# EasyEDA Pro project 电子琴.eprj

# Board PCB
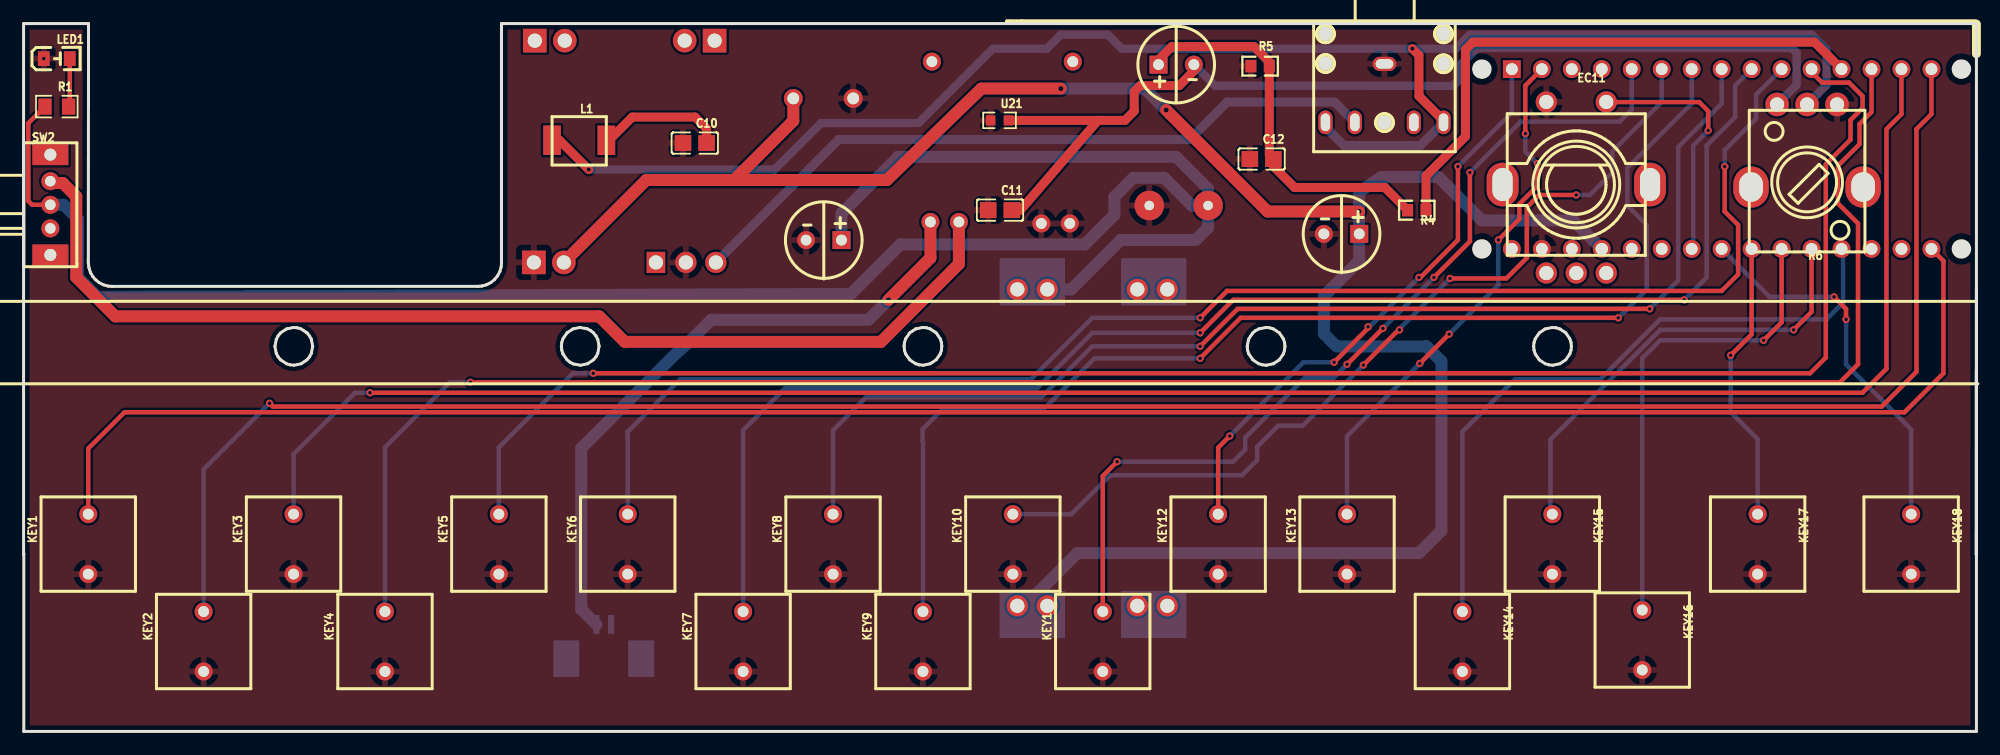
[diagram p0: board, top side]
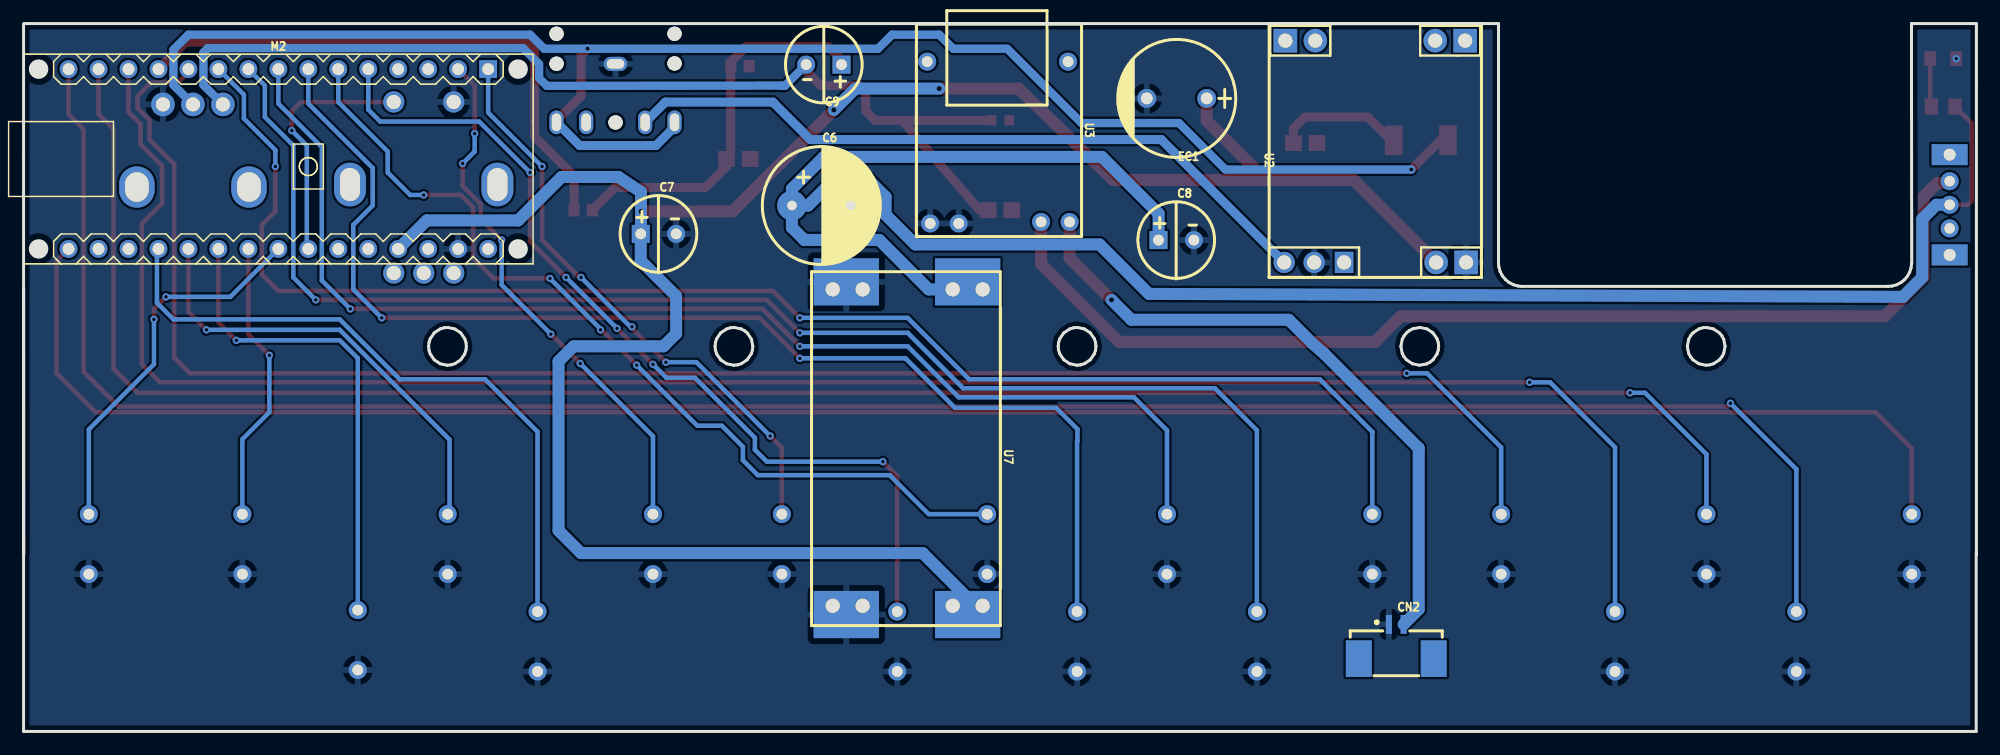
[diagram p1: board, bottom side, seen from below]

Outline 165.5 x 59.99 mm; copper layers: Top Layer, Bottom Layer. Coordinates in mm from the lower left corner of the outline.
Outline path: 0,14.99 0,59.99 5.5,59.99 5.5,54.99 5.48,39.65 ; 0.02,15.11 0.02,0 165.5,0 165.5,59.94 165.45,59.99 40.5,59.99 40.5,39.67 40.47,39.38 40.36,38.98 40.18,38.62 39.92,38.3 39.6,38.04 39.24,37.86 38.84,37.75 38.5,37.72 7.51,37.72 7.15,37.74 6.76,37.85 6.4,38.04 6.08,38.3 5.86,38.56 5.66,38.92 5.53,39.31 5.49,39.71 ; 165.48,14.99 165.5,37.6 ; 21.3,32.64 21.41,33.23 21.57,33.52 21.78,33.78 22.28,34.11 22.87,34.24 23.2,34.21 23.52,34.11 24.02,33.78 24.23,33.52 24.39,33.23 24.5,32.64 24.39,32.04 24.23,31.75 24.02,31.5 23.52,31.16 22.93,31.04 22.6,31.06 22.28,31.16 21.78,31.5 21.57,31.75 21.41,32.04 21.3,32.64 ; 45.58,32.64 45.61,32.97 45.71,33.28 46.05,33.78 46.56,34.11 47.15,34.24 47.74,34.13 48.04,33.98 48.3,33.78 48.51,33.52 48.66,33.23 48.78,32.64 48.66,32.04 48.51,31.75 48.3,31.5 47.79,31.16 47.2,31.04 46.61,31.14 46.31,31.29 46.05,31.5 45.71,31.99 45.61,32.31 45.58,32.64 ; 74.62,32.64 74.65,32.97 74.75,33.28 75.1,33.78 75.6,34.11 76.19,34.24 76.52,34.21 76.84,34.11 77.34,33.78 77.68,33.28 77.78,32.97 77.82,32.64 77.78,32.31 77.68,31.99 77.34,31.5 76.84,31.16 76.25,31.04 75.92,31.07 75.6,31.16 75.1,31.5 74.75,31.99 74.65,32.31 74.62,32.64 ; 103.7,32.64 103.81,33.23 104.14,33.74 104.39,33.95 104.68,34.11 105.27,34.24 105.6,34.21 105.92,34.11 106.42,33.78 106.76,33.28 106.86,32.97 106.9,32.64 106.86,32.31 106.76,31.99 106.42,31.5 105.92,31.16 105.33,31.04 105,31.06 104.68,31.16 104.18,31.5 103.83,31.99 103.73,32.31 103.7,32.64 ; 127.98,32.64 128.01,32.97 128.11,33.28 128.45,33.78 128.96,34.11 129.55,34.24 129.88,34.21 130.19,34.11 130.7,33.78 131.04,33.28 131.14,32.97 131.18,32.64 131.14,32.31 131.04,31.99 130.7,31.5 130.19,31.16 129.6,31.04 129.27,31.06 128.96,31.16 128.45,31.5 128.11,31.99 128.01,32.31 127.98,32.64
Stack: Top Layer 0.035mm / Dielectric1 1.51mm FR4 er 4.5 / Bottom Layer 0.035mm

## Design rules (mm)
template: JLCPCB Capability(Two Layers Board)
spacing copperThickness1oz (default): track to track 0.102, other pairs 0.152 to 0.3
spacing copperThickness2oz: track to track 0.203, other pairs 0.152 to 0.3
track width copperThickness1oz (default): min 0.127, default 0.254, max 2.54
track width copperThickness2oz: min 0.203, default 0.254, max 2.54
differential pair differentialPair (default): width min 0.127, default 0.254, max 2.54; gap min 0.152, default 0.152
via viaSize (default): diameter min 0.5, default 0.61, max 10; hole min 0.3, default 0.305, max 6.3

## Placement (name value [footprint] x y rotation side)
C6  1000uF  [CAP1000UFX25V-10X20(5MM, D-0.8)]  97.89 44.57 180 bottom
C7  直插电容10UF  [直插电容]  111.7 42.17 180 bottom
C8  直插电容10UF  [直插电容]  67.81 41.64 180 bottom
C9  直插电容10UF  [直插电容]  97.68 56.51 0 bottom
C10  220nF  [C0805]  56.88 49.86 0 top
C11  470nF  [C0805]  82.75 44.18 0 top
C12  100nF  [C0805]  104.92 48.51 0 top
CN2  1.25-2P  [CONN-SMD_1.25-2P]  49.17 7.62 180 bottom
EC1  4700uF  [CAP-TH_BD10.0-P5.00-D1.0-FD]  67.77 53.65 0 bottom
EC11  EC11编码器  [EC11]  131.59 46.1 0 top
KEY1  无声按键  [无声硅胶轻触按键开关 8*8两脚 导电胶]  5.48 15.87 90 top
KEY2  无声按键  [无声硅胶轻触按键开关 8*8两脚 导电胶]  15.26 7.62 90 top
KEY3  无声按键  [无声硅胶轻触按键开关 8*8两脚 导电胶]  22.88 15.87 90 top
KEY4  无声按键  [无声硅胶轻触按键开关 8*8两脚 导电胶]  30.63 7.62 90 top
KEY5  无声按键  [无声硅胶轻触按键开关 8*8两脚 导电胶]  40.28 15.87 90 top
KEY6  无声按键  [无声硅胶轻触按键开关 8*8两脚 导电胶]  51.2 15.87 90 top
KEY7  无声按键  [无声硅胶轻触按键开关 8*8两脚 导电胶]  60.98 7.62 90 top
KEY8  无声按键  [无声硅胶轻触按键开关 8*8两脚 导电胶]  68.6 15.87 90 top
KEY9  无声按键  [无声硅胶轻触按键开关 8*8两脚 导电胶]  76.22 7.62 90 top
KEY10  无声按键  [无声硅胶轻触按键开关 8*8两脚 导电胶]  83.84 15.87 90 top
KEY11  无声按键  [无声硅胶轻触按键开关 8*8两脚 导电胶]  91.46 7.62 90 top
KEY12  无声按键  [无声硅胶轻触按键开关 8*8两脚 导电胶]  101.24 15.87 90 top
KEY13  无声按键  [无声硅胶轻触按键开关 8*8两脚 导电胶]  112.16 15.87 90 top
KEY14  无声按键  [无声硅胶轻触按键开关 8*8两脚 导电胶]  121.94 7.62 270 top
KEY15  无声按键  [无声硅胶轻触按键开关 8*8两脚 导电胶]  129.56 15.87 270 top
KEY16  无声按键  [无声硅胶轻触按键开关 8*8两脚 导电胶]  137.18 7.75 270 top
KEY17  无声按键  [无声硅胶轻触按键开关 8*8两脚 导电胶]  146.96 15.87 270 top
KEY18  无声按键  [无声硅胶轻触按键开关 8*8两脚 导电胶]  159.97 15.87 270 top
L1  0420贴片电感 10uh  [0420贴片电感]  44.79 52.11 0 top
LED1  LED0805  [LED0805-RD]  2.81 57.02 0 top
M2  -  [ARDUINO-NANO-3.0]  143.91 48.51 180 bottom
R1  1kΩ  [R0805]  2.81 52.96 0 top
R4  220  [R 0603]  118.07 44.18 180 top
R5  100  [R 0603]  104.79 56.39 0 top
R6  10K  [RV09_RV0932]  151.15 49.64 180 top
SW2  SK12D07VG3  [SWITCH-SK12D07VG3]  2.27 42.63 0 top
U2  PAM8403模组  [PAM8403小板]  50.95 38.48 90 bottom
U3  -  [超小TP4056充放保护模块]  84.22 46.1 270 bottom
U7  -  [XL63070]  86.76 37.46 270 bottom
U19  USB_Switch-Box-rescue_Audio_Jack_PJ-307C-JLC_Audio_Jack  [AUDIO-PJ307C]  115.33 55.37 0 top
U21  1.8K  [R0603]  82.71 51.79 0 top

## Footprints (pads in the part's own frame, mm; a bottom-side part is the same pattern mirrored in y, then rotated)
0420贴片电感
  rect 1.5x2.5 smd: 1(0,-2) 2(4.602,-2.002)
ARDUINO-NANO-3.0
  rect 1.508x1.508 hole 1x1: J1.1(17.78,7.62)
  round 1.508 hole 1x1: J1.2(15.24,7.62) J1.3(12.7,7.62) J1.4(10.16,7.62) J1.5(7.62,7.62) J1.6(5.08,7.62) J1.7(2.54,7.62) J1.8(0,7.62) J1.9(-2.54,7.62) J1.10(-5.08,7.62) J1.11(-7.62,7.62) J1.12(-10.16,7.62) J1.13(-12.7,7.62) J1.14(-15.24,7.62) J1.15(-17.78,7.62) J2.1(17.78,-7.62) J2.2(15.24,-7.62) J2.3(12.7,-7.62) J2.5(7.62,-7.62) J2.6(5.08,-7.62) J2.7(2.54,-7.62) J2.8(0,-7.62) J2.9(-2.54,-7.62) J2.10(-5.08,-7.62) J2.11(-7.62,-7.62) J2.12(-10.16,-7.62) J2.13(-12.7,-7.62) J2.14(-15.24,-7.62) J2.15(-17.78,-7.62)
  round 1.508 hole 1.05x1: J2.4(10.16,-7.62)
AUDIO-PJ307C
  round 1.2 hole 1.2: 0(-5,3.76) 0(-5,1.244) 0(0,-3.76) 0(5,3.76) 0(5,1.22)
  oval 2x1.2 hole 1.5x0.8: 1(0,1.205)
  oval 1.2x2 hole 0.8x1.5: 2(5.004,-3.748) 3(2.489,-3.748) 4(-2.511,-3.748) 5(-5.004,-3.748)
C0805
  rect 1.41x1.35 smd: 1(-1,0) 2(1,0)
CAP1000UFX25V-10X20(5MM, D-0.8)
  round 2.5 hole 0.8: 1(-2.491,0) 2(2.492,0)
CAP-TH_BD10.0-P5.00-D1.0-FD
  round 1.6 hole 1: 1(-2.54,0) 2(2.54,0)
CONN-SMD_1.25-2P
  rect 0.52x1.6 smd: 1(-0.625,1.45) 2(0.625,1.45)
  rect 2.2x3.1 smd: 3(3.175,-1.45) 4(-3.175,-1.45)
EC11
  oval 2.7x3.7 hole 1.7x2.8: 0(-6.25,0.25) 0(6.25,0.25)
  round 1.8 hole 1.2: A(-2.54,-7.25) B(2.54,-7.25) C(0,-7.25) D(-2.54,7.25) E(2.54,7.25)
LED0805-RD
  rect 1x1.25 smd: 1(-1.1,0) 2(1.1,0)
PAM8403小板
  round 1.8 hole 1.2: 1(1.27,7.723) 2(1.27,5.183)
  rect 1.8x1.575 hole 1.2: 3(1.27,2.643)
  round 2 hole 1.2: 4(1.27,-5.16) 7(20.066,5.08) 8(20.066,-5.08)
  rect 2x2 hole 1.2: 5(1.27,-7.7) 6(20.066,7.62) 9(20.066,-7.62)
R0603
  rect 0.806x0.864 smd: 1(-0.753,0) 2(0.753,0)
R0805
  rect 1.133x1.377 smd: 1(-1,0) 2(1,0)
R 0603
  rect 0.94x1.06 smd: 1(-0.78,0) 2(0.78,0)
RV09_RV0932
  round 2 hole 1.2: 1(-2.54,-3.5) 2(0,-3.5) 3(2.54,-3.5)
  oval 3x3.5 hole 2x2.5: 4(4.75,3.5) 5(-4.75,3.5)
SWITCH-SK12D07VG3
  round 1.524 hole 0.889: 1(0,4) 2(0,2) 3(0,0)
  rect 0x0 hole 1.016: 4(-0.5,6.25) 4(-0.5,-2.25) 4(0.5,6.25) 4(0.5,-2.25)
  rect 3.048x1.778 hole 1.016: 4(0,6.25) 4(0,-2.25)
XL63070
  rect 4x5.54 smd: 1(-0.635,1.27) 2(-0.635,-9.017) 3(27.559,1.27) 4(27.559,-9.017)
  round 1.8 hole 1.2: 1(0,0) 1(0,2.54) 2(0,-10.17) 2(0,-7.63) 3(26.82,0) 3(26.82,2.54) 4(26.82,-10.17) 4(26.82,-7.63)
无声硅胶轻触按键开关 8*8两脚 导电胶
  round 1.524 hole 0.914: 1(-2.54,0) 2(2.54,0)
直插电容
  rect 1.524x1.524 hole 0.914: 1(-1.5,0)
  round 1.524 hole 0.914: 2(1.5,0)
超小TP4056充放保护模块
  round 1.524 hole 0.914: 1(-10.668,7.239) 2(-10.668,-4.699) 3(3.048,-4.445) 4(3.048,-2.032) 5(2.921,4.953) 6(2.921,7.366)

## Nets
5V: C7.1 EC1.1 M2.J2.4 U2.4 U7.3
GND: C6.2 C7.2 C8.2 C10.1 C11.1 C12.1 CN2.1 EC1.2 EC11.D KEY1.1 KEY2.1 KEY3.1 KEY4.1 KEY5.1 KEY6.1 KEY7.1 KEY8.1 KEY9.1 KEY10.1 KEY11.1 KEY12.1 KEY13.1 KEY14.2 KEY15.2 KEY16.2 KEY17.2 KEY18.2 LED1.1 M2.J2.2 R5.1 R6.1 U2.2 U2.5 U3.3 U3.4 U7.2 U7.4 U19.1 U21.1
BAT: CN2.2 U3.6
C6_1: C6.1 C8.1 R1.1 SW2.2 U7.1
C9_1: C9.1 C12.2 R4.2 R5.2
C9_2: C9.2 C11.2 R6.3 U21.2
D9: M2.J1.12 R4.1
EC11_0: EC11.0
EC11_A: EC11.A
EC11_B: EC11.B
EC11_C: EC11.C
EC11_E: EC11.E M2.J2.7
L1_1: L1.1 R6.2 U19.2 U19.5
L1_2: C10.2 L1.2
LED1_2: LED1.2 R1.2
M2_J1.1: KEY12.2 M2.J1.1
M2_J1.2: KEY13.2 M2.J1.2
M2_J1.3: M2.J1.3
M2_J1.4: M2.J1.4
M2_J1.5: KEY11.2 M2.J1.5
M2_J1.6: KEY10.2 M2.J1.6
M2_J1.7: KEY9.2 M2.J1.7
M2_J1.8: KEY8.2 M2.J1.8
M2_J1.9: KEY7.2 M2.J1.9
M2_J1.10: KEY6.2 M2.J1.10
M2_J1.11: KEY5.2 M2.J1.11
M2_J1.13: KEY4.2 M2.J1.13
M2_J1.14: KEY3.2 M2.J1.14
M2_J1.15: KEY2.2 M2.J1.15
M2_J2.1: M2.J2.1
M2_J2.3: M2.J2.3
M2_J2.5: M2.J2.5
M2_J2.6: M2.J2.6
M2_J2.8: KEY18.1 M2.J2.8
M2_J2.9: KEY17.1 M2.J2.9
M2_J2.10: KEY16.1 M2.J2.10
M2_J2.11: KEY15.1 M2.J2.11
M2_J2.12: KEY14.1 M2.J2.12
M2_J2.13: M2.J2.13
M2_J2.14: M2.J2.14
M2_J2.15: KEY1.2 M2.J2.15
SW2_1: SW2.1 U3.5
SW2_3: SW2.3
U3_1: U3.1
U3_2: U3.2
U19_4: U2.1 U19.4

Pads without a net: CN2 3 4; R6 4 5; SW2 4; U2 3 6 7 8 9; U19 0 3

## Via types
v1: diameter 0.7, hole 0.35, Top Layer to Bottom Layer, 2 vias
v2: diameter 0.889, hole 0.432, Top Layer to Bottom Layer, 4 vias
v3: diameter 0.62, hole 0.31, Top Layer to Bottom Layer, 38 vias

## Routing (per net, layer and track width the routed paths; a pad name or vN(x,y) marks a point on that pad's centre or on a via; arc(x,y) is an arc through that point)
5V: length 187.1
  Top Layer w1.016: EC1.1 65.23,51.75 60.22,46.73 ; v2(96.83,52.67) 105.43,44.07 v2(113.18,44.07) ; 60.22,46.73 73.17,46.73 81.17,54.48 v2(87.9,54.48) ; 60.22,46.73 52.77,46.73 U2.4
  Bottom Layer w1.016: v2(87.9,54.48) 95.01,54.48 v2(96.83,52.67) ; 113.18,42.2 v2(113.18,44.07) 113.18,45.72 115.08,46.99 119.91,46.99 123.59,43.31 131.34,43.31 M2.J2.4 ; U7.3 85.49,11.3 89.3,15.11 118.26,15.11 120.16,17.02 120.16,31.37 118.89,32.64 111.27,32.64 110.2,33.71 110.2,36.9 113.2,39.9 C7.1
GND:
  vias: v3(1.71,57.02)
BAT: length 54.7
  Top Layer w1.016: v2(73.3,36.58) 76.85,40.13 U3.6
  Bottom Layer w1.016: v2(73.3,36.58) 71.61,34.89 58.28,34.89 56.28,32.89 55.26,32 47.26,24 47.26,10.35 CN2.2
C6_1: length 176.3
  Top Layer w0.381: R1.1 0.4,51.55 0.4,44.96 0.72,44.63 SW2.2
  Bottom Layer w1.016: C6.1 100.38,45.99 97.68,48.69 74.11,48.69 69.31,43.9 C8.1 ; C6.1 99.01,44.57 96.67,46.92 94.05,46.92 92.44,45.31 92.44,43.78 89.93,41.27 74.31,41.27 70.12,37.08 6.24,36.83 4.59,38.48 4.59,43.43 3.39,44.63 2.27,44.63 ; C6.1 100.38,42.71 99.33,41.66 92.98,41.66 88.79,37.46 U7.1
C9_1: length 32.7
  Top Layer w0.762: C9.1 96.18,56.92 97.3,58.04 104.29,58.04 105.57,56.75 R5.2 105.57,48.86 C12.2 105.92,47.89 107.71,46.1 115.37,46.1 R4.2
C9_2: length 89
  Top Layer w0.762: 91.05,51.79 84.49,44.18 C11.2 ; 91.05,51.79 93.34,51.79 94.13,52.58 94.13,54.23 94.63,54.74 97.94,54.74 99.18,55.98 C9.2 ; 91.05,51.79 83.46,51.79
  Bottom Layer w0.7: 101.11,54.74 121.15,54.71 121.81,55.37 121.81,56.56 123.17,57.91 149.88,57.91 150.26,57.53 150.26,54.79 148.61,53.14 ; C9.2 100.98,54.71 101.26,54.71
D9: length 48.1
  Top Layer w0.762: R4.1 118.85,47.08 122.19,50.42 122.19,57.78 122.83,58.42 151.78,58.42 M2.J1.12
EC11_E: length 21.2
  Top Layer w0.381: v3(142.77,50.93) 142.77,52.58 142,53.34 134.13,53.34
  Bottom Layer w0.381: v3(142.77,50.93) 141.5,49.66 141.5,41.02 M2.J2.7
L1_1: length 139.8
  Top Layer w0.762: L1.1 45.42,50.11 v1(47.9,47.62) ; U19.2 120.34,51.76 118.26,53.85 118.26,57.31 v1(117.7,57.86)
  Bottom Layer w0.7: R6.2 152.8,54.79 152.8,57.78 151.53,59.05 122.57,59.05 121.38,57.86 v1(117.7,57.86) 93.08,57.86 91.89,59.05 87.9,59.05 86.71,57.86 82.14,57.86 75.84,51.56 67.58,51.56 63.65,47.62 v1(47.9,47.62)
  Bottom Layer w0.762: U19.5 110.33,51.23 111.91,49.66 118.37,49.66 U19.2
L1_2: length 10.9
  Top Layer w0.762: L1.2 49.61,50.1 51.58,52.07 56.91,52.07 57.88,51.1 C10.2
LED1_2: length 4.1
  Top Layer w0.381: R1.2 3.91,53.06 LED1.2
M2_J1.1: length 49.7
  Top Layer w0.381: v3(118.26,38.48) 118.38,38.48 121.56,41.66 v3(121.56,47.88) ; v3(102.23,25.04) 101.24,24.05 KEY12.2 ; v3(113.94,34.29) 113.94,34.16 v3(111.07,31.29)
  Bottom Layer w0.381: M2.J1.1 126.13,52.45 v3(121.56,47.88) ; 111.07,31.29 108.48,31.29 v3(102.23,25.04) ; v3(113.94,34.29) 114.06,34.29 v3(118.26,38.48)
M2_J1.2: length 45.4
  Top Layer w0.381: v3(124.99,41.66) 126.76,43.43 126.76,44.7 128.29,46.23 v3(128.29,48.13) ; v3(118.33,31.18) v3(120.81,33.67) ; M2.J1.2 127.27,54.74 v3(127.27,50.67)
  Bottom Layer w0.381: v3(128.29,48.13) 127.27,49.15 v3(127.27,50.67) ; v3(118.33,31.18) 112.16,25.02 KEY13.2 ; v3(124.99,41.66) 124.99,37.84 v3(120.81,33.67)
M2_J1.5: length 76.6
  Top Layer w0.381: KEY11.2 91.46,21.64 v3(92.67,22.86) ; v3(122.57,47.37) 122.57,41.53 v3(119.53,38.48) ; v3(112.16,31.11) v3(115.21,34.16)
  Bottom Layer w0.381: v3(122.57,47.37) 126.89,51.69 135.27,51.69 136.29,52.7 M2.J1.5 ; v3(112.16,31.11) 111.02,29.97 108.6,29.97 103.52,24.89 103.52,23.88 102.51,22.86 v3(92.67,22.86) ; v3(115.21,34.16) v3(119.53,38.48)
M2_J1.6: length 76.6
  Top Layer w0.381: v3(131.59,45.47) 128.45,45.47 127.4,44.42 127.4,40.13 125.66,38.39 v3(120.89,38.39) 120.82,38.47 ; v3(113.54,31.05) 116.53,34.03 v3(116.6,34.03)
  Bottom Layer w0.381: v3(131.59,45.47) 132.73,45.47 134.64,47.37 134.64,49.15 138.83,53.34 M2.J1.6 ; v3(116.6,34.03) 116.6,34.11 v3(120.89,38.39) ; v3(113.54,31.05) 108.4,25.91 106.32,25.91 104.54,24.13 104.54,22.99 103.27,21.72 92.09,21.72 88.79,18.41 KEY10.2
M2_J1.7: length 103.4
  Top Layer w0.381: v3(99.71,31.62) 103.14,35.05 v3(135.15,35.05)
  Bottom Layer w0.381: v3(135.15,35.05) 137.56,37.46 137.56,42.92 135.91,44.58 135.91,47.75 141.37,53.21 M2.J1.7 ; v3(99.71,31.62) 90.76,31.62 86.57,27.43 78,27.43 76.19,25.62 76.19,24.6 76.22,24.57 KEY9.2
M2_J1.8: length 103.4
  Top Layer w0.381: v3(99.71,32.64) 102.89,35.81 v3(137.81,35.81)
  Bottom Layer w0.381: v3(99.71,32.64) 90.57,32.64 86.25,28.32 71.4,28.32 68.6,25.52 KEY8.2 ; v3(137.81,35.81) 140.23,38.23 140.23,49.53 143.91,53.21 M2.J1.8
M2_J1.9: length 121.6
  Top Layer w0.381: v3(140.73,36.58) 102.51,36.58 v3(99.71,33.78)
  Bottom Layer w0.381: v3(99.71,33.78) 90.57,33.78 85.87,29.08 64.53,29.08 60.98,25.53 KEY7.2 ; M2.J1.9 145.05,54.74 145.05,52.07 142.64,49.66 142.64,38.48 v3(140.73,36.58)
M2_J1.10: length 126.6
  Top Layer w0.381: v3(99.71,35.05) 102,37.34 143.91,37.34 145.31,38.73 145.31,42.92 144.16,44.07 v3(144.16,47.88) 144.29,47.88
  Bottom Layer w0.381: v3(99.71,35.05) 90.57,35.05 85.36,29.84 55.64,29.84 51.16,25.36 51.2,25.31 KEY6.2 ; M2.J1.10 146.83,53.97 146.83,51.94 144.16,49.27 v3(144.16,47.88)
M2_J1.11: length 150.1
  Top Layer w0.381: M2.J1.11 151.53,55.88 152.42,54.99 154.7,54.99 155.85,53.85 155.85,52.83 154.83,51.81 154.83,50.16 152.74,48.07 152.74,31.69 151.4,30.35 v3(48.28,30.35)
  Bottom Layer w0.381: v3(48.28,30.35) 46.55,30.35 40.28,24.08 KEY5.2
M2_J1.13: length 168.6
  Top Layer w0.381: v3(37.86,29.59) 153.94,29.59 155.47,31.11 155.47,43.05 153.76,44.76 153.77,47.95 155.59,49.77 155.59,51.47 156.61,52.49 M2.J1.13
  Bottom Layer w0.381: KEY4.2 30.63,24.08 36.13,29.59 v3(37.86,29.59)
M2_J1.14: length 169
  Top Layer w0.381: M2.J1.14 159.15,52.32 157.88,51.05 157.88,30.73 155.85,28.7 v3(29.36,28.7)
  Bottom Layer w0.381: KEY3.2 22.88,23.49 28.09,28.7 v3(29.36,28.7)
M2_J1.15: length 187.1
  Top Layer w0.381: M2.J1.15 161.69,52.32 160.42,51.05 160.42,30.48 157.47,27.53 21.13,27.53 v3(20.85,27.81)
  Bottom Layer w0.381: KEY2.2 15.26,22.22 v3(20.85,27.81)
M2_J2.8: length 32.3
  Top Layer w0.381: v3(153.43,36.83) 154.45,35.81 v3(154.45,34.92)
  Bottom Layer w0.381: v3(154.45,34.92) 154.45,31.11 159.97,25.59 KEY18.1 ; M2.J2.8 147.97,36.83 v3(153.43,36.83)
M2_J2.9: length 24.2
  Top Layer w0.381: v3(144.67,31.88) 146.45,33.65 M2.J2.9
  Bottom Layer w0.381: v3(144.67,31.88) 144.67,27.05 146.96,24.76 KEY17.1
M2_J2.10: length 40.5
  Top Layer w0.381: v3(147.47,33.15) 148.99,34.67 M2.J2.10
  Bottom Layer w0.381: 138.58,33.02 137.18,31.64 KEY16.1 ; 138.7,33.15 v3(147.47,33.15)
M2_J2.11: length 38.4
  Top Layer w0.381: v3(150.01,34.03) 151.53,35.56 M2.J2.11
  Bottom Layer w0.381: KEY15.1 129.4,18.41 129.4,24.74 138.7,34.03 v3(150.01,34.03)
M2_J2.12: length 56.6
  Bottom Layer w0.381: M2.J2.12 154.2,40.77 154.2,36.32 152.8,34.92 138.7,34.92 133.62,29.84 126.38,29.84 121.94,25.4 KEY14.1
M2_J2.15: length 176.4
  Top Layer w0.381: KEY1.2 5.48,23.98 8.55,27.05 159.4,27.05 162.71,30.35 162.71,39.88 M2.J2.15
SW2_1: length 92.9
  Top Layer w1.016: 2.27,46.64 2.42,46.48 3.32,46.48 4.46,45.34 4.46,38.48 7.77,35.18 48.79,35.18 50.95,33.02 72.66,33.02 79.27,39.62 U3.5
U19_4: length 60.5
  Bottom Layer w0.762: U2.1 69.08,50.16 98.82,50.16 102,53.34 111.11,53.34 112.82,51.62

## Copper pours and planes (outline as drawn; the poured copper is in the pictures)
GND on Top Layer: -22.33,75.69 187.22,75.69 189.25,77.72 189.25,-18.16 187.6,-19.81 -18.65,-19.81 -23.73,-14.73
GND on Bottom Layer: -18.52,76.96 181.88,76.96 186.71,81.79 186.71,-11.3 189.12,-13.72 -13.82,-13.72 -16.49,-11.05
